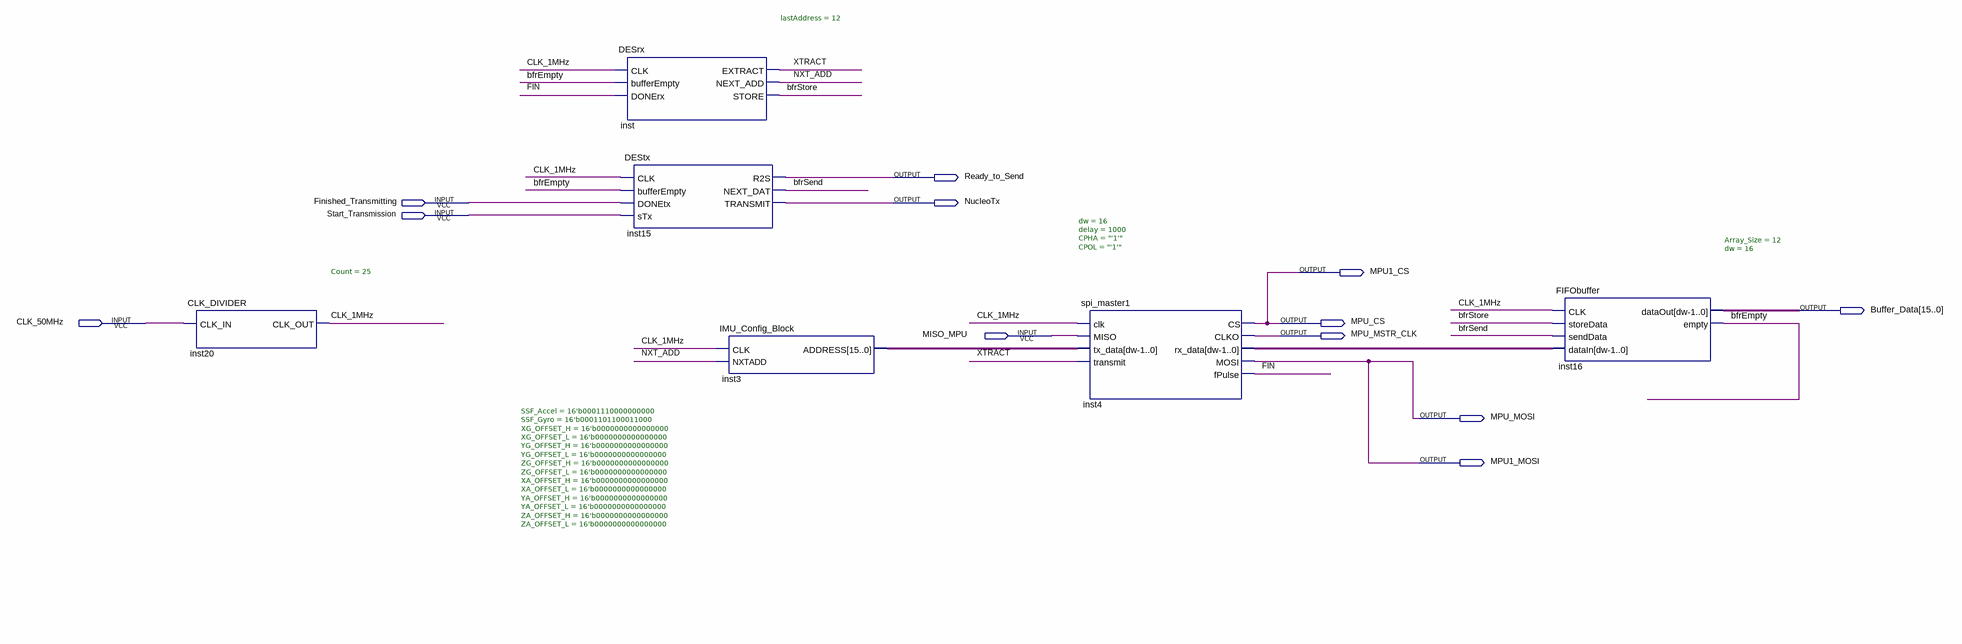
[diagram p0: schematic sheet]
// Quartus schematic CONFIG_IMU.bdf as structural Verilog: 6 symbols, 12 pins
module CONFIG_IMU (
  input  Finished_Transmitting,
  input  Start_Transmission,
  input  CLK_50MHz,
  input  MISO_MPU,
  output Ready_to_Send,
  output NucleoTx,
  output MPU1_CS,
  output [15:0] Buffer_Data,
  output MPU_CS,
  output MPU_MSTR_CLK,
  output MPU_MOSI,
  output MPU1_MOSI
);

  wire bfrEmpty, bfrSend, bfrStore, CLK_1MHz, FIN, NXT_ADD, XTRACT;
  wire [15:0] inst3_address, inst4_rx_data;

  CLK_DIVIDER #(.Count(25)) inst20 (.CLK_IN(CLK_50MHz), .CLK_OUT(CLK_1MHz));
  DESrx #(.lastAddress(12)) inst (
    .CLK(CLK_1MHz), .bufferEmpty(bfrEmpty), .DONErx(FIN), .EXTRACT(XTRACT), .NEXT_ADD(NXT_ADD),
    .STORE(bfrStore));
  DEStx inst15 (
    .CLK(CLK_1MHz), .bufferEmpty(bfrEmpty), .DONEtx(Finished_Transmitting), .sTx(Start_Transmission),
    .R2S(Ready_to_Send), .NEXT_DAT(bfrSend), .TRANSMIT(NucleoTx));
  IMU_Config_Block #(.SSF_Accel(16'b0001110000000000), .SSF_Gyro(16'b0001101100011000), .XG_OFFSET_H(16'b0000000000000000), .XG_OFFSET_L(16'b0000000000000000), .YG_OFFSET_H(16'b0000000000000000), .YG_OFFSET_L(16'b0000000000000000), .ZG_OFFSET_H(16'b0000000000000000), .ZG_OFFSET_L(16'b0000000000000000), .XA_OFFSET_H(16'b0000000000000000), .XA_OFFSET_L(16'b0000000000000000), .YA_OFFSET_H(16'b0000000000000000), .YA_OFFSET_L(16'b0000000000000000), .ZA_OFFSET_H(16'b0000000000000000), .ZA_OFFSET_L(16'b0000000000000000)) inst3 (
    .CLK(CLK_1MHz), .NXTADD(NXT_ADD), .ADDRESS(inst3_address));
  spi_master1 #(.dw(16), .delay(1000), .CPHA("'1'"), .CPOL("'1'")) inst4 (
    .clk(CLK_1MHz), .MISO(MISO_MPU), .tx_data(inst3_address), .transmit(XTRACT), .CS(MPU1_CS),
    .CLKO(MPU_MSTR_CLK), .rx_data(inst4_rx_data), .MOSI(MPU1_MOSI), .fPulse(FIN));
  FIFObuffer #(.Array_Size(12), .dw(16)) inst16 (
    .CLK(CLK_1MHz), .storeData(bfrStore), .sendData(bfrSend), .dataIn(inst4_rx_data), .dataOut(Buffer_Data),
    .empty(bfrEmpty));

  assign MPU_CS = MPU1_CS;
  assign MPU_MOSI = MPU1_MOSI;
endmodule
